# EAGLE design System critical signals PCB (EAGLE 9.5.0)
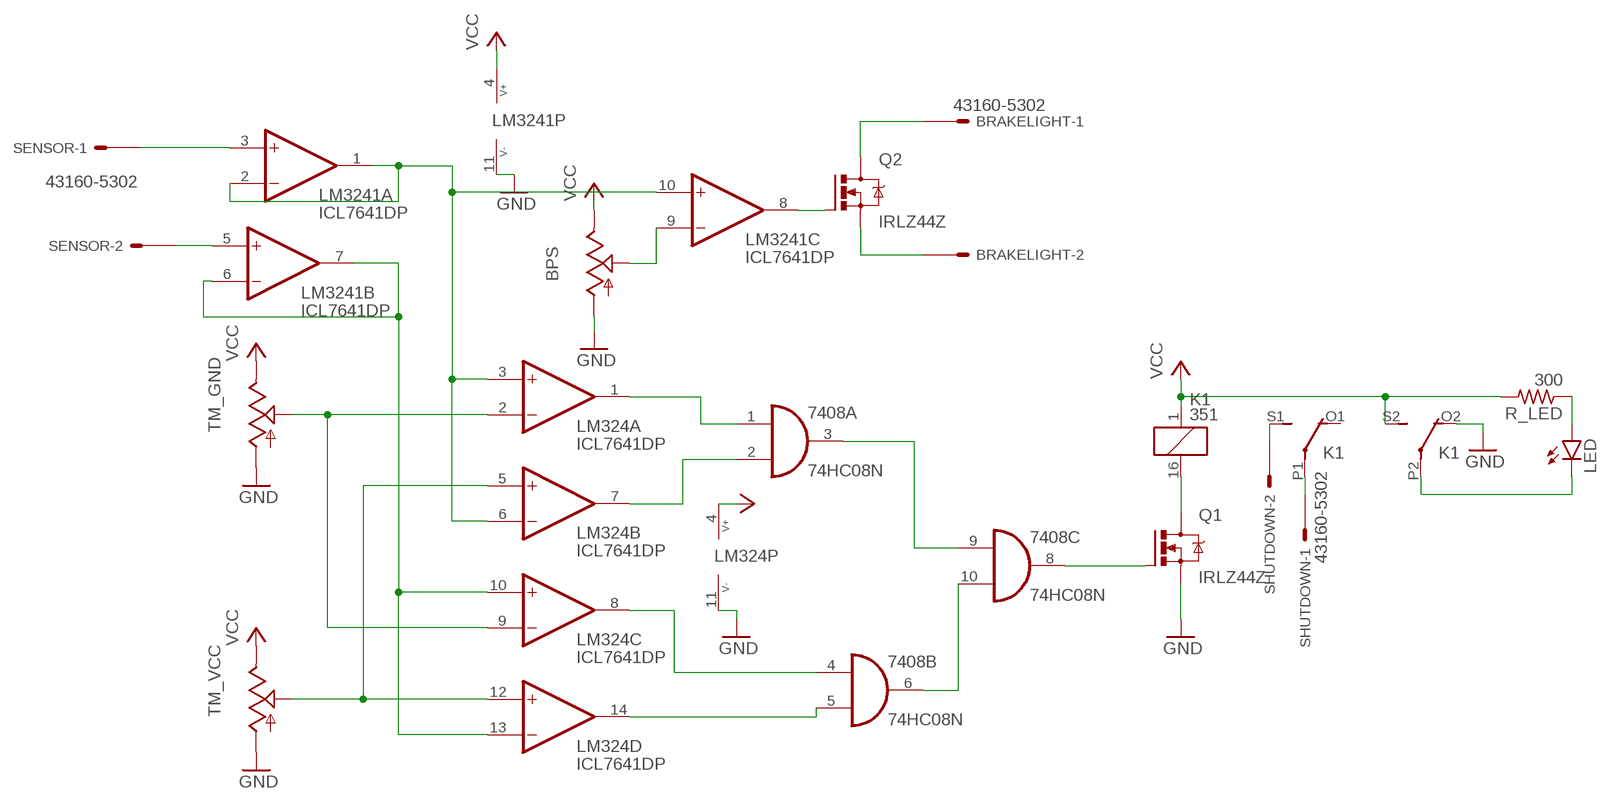
[diagram p0: schematic, sheet 1]

## Parts
7408  74HC08N  [DIL14]
BPS  TRIM  [6MM]
BRAKELIGHT  43160-5302  [43160-XX02]
K1  351  [351]
LED  LEDCHIP-LED0805  [CHIP-LED0805]
LM324  ICL7641DP  [DIL14]
LM3241  ICL7641DP  [DIL14]
Q1  IRLZ44Z  [TO220BH]
Q2  IRLZ44Z  [TO220BH]
R_LED  300  R-US_M0805  [M0805]
SENSOR  43160-5302  [43160-XX02]
SHUTDOWN  43160-5302  [43160-XX02]
TM_GND  TRIM  [6MM]
TM_VCC  TRIM  [6MM]

## Nets
BPS: LM3241.3(A:+IN) SENSOR.1@1(-1:S)
GND: BPS.A K1.O2(3:O) LM324.11(P:V-) LM3241.11(P:V-) Q1.S TM_GND.A TM_VCC.A
N$1: 7408.4(B:I0) LM324.8(C:OUT)
N$2: LM324.3(A:+IN) LM324.6(B:-IN) LM3241.1(A:OUT) LM3241.2(A:-IN) LM3241.10(C:+IN)
N$3: LM324.10(C:+IN) LM324.13(D:-IN) LM3241.6(B:-IN) LM3241.7(B:OUT)
N$4: 7408.5(B:I1) LM324.14(D:OUT)
N$5: 7408.1(A:I0) LM324.1(A:OUT)
N$6: 7408.2(A:I1) LM324.7(B:OUT)
N$7: 7408.3(A:O) 7408.9(C:I0)
N$8: 7408.6(B:O) 7408.10(C:I1)
N$9: 7408.8(C:O) Q1.G
N$10: K1.16 Q1.D
N$11: K1.S1(2:S) SHUTDOWN.2@1(-2:S)
N$12: K1.P1(2:P) SHUTDOWN.1@1(-1:S)
N$13: LED.A R_LED.1
N$14: BPS.S LM3241.9(C:-IN)
N$15: LM3241.8(C:OUT) Q2.G
N$16: BRAKELIGHT.1@1(-1:S) Q2.D
N$17: BRAKELIGHT.2@1(-2:S) Q2.S
N$18: K1.P2(3:P) LED.C
N$23: LM324.2(A:-IN) LM324.9(C:-IN) TM_GND.S
N$25: LM324.5(B:+IN) LM324.12(D:+IN) TM_VCC.S
TPS: LM3241.5(B:+IN) SENSOR.2@1(-2:S)
VCC: BPS.E K1.1 K1.S2(3:S) LM324.4(P:V+) LM3241.4(P:V+) R_LED.2 TM_GND.E TM_VCC.E
Unconnected: 7408.11(D:O) 7408.12(D:I0) 7408.13(D:I1) BRAKELIGHT.1@2(-1:S) BRAKELIGHT.2@2(-2:S) K1.O1(2:O) LM3241.12(D:+IN) LM3241.13(D:-IN) LM3241.14(D:OUT) SENSOR.1@2(-1:S) SENSOR.2@2(-2:S) SHUTDOWN.1@2(-1:S) SHUTDOWN.2@2(-2:S)

## Power pins joined to a net without a drawn wire
GND: 7408.7(P:GND)
VCC: 7408.14(P:VCC)

## Library data of the parts
7408 = 74xx-eu:74*08: Quad 2-input AND gate
BPS TM_GND TM_VCC = adafruit:TRIM
BRAKELIGHT SENSOR SHUTDOWN = con-molex:43160-*02: SDA-43160 Connector Source: http://www.molex.com/pdm_docs/sd/431601306_sd.pdf; MF: MOLEX; MPN: 43160-5302; OC_FARNELL: unknown; OC_NEWARK: 92M1498
K1 = relay:351: RELAY 2 x switch, Omron; OC_FARNELL: unknown; OC_NEWARK: unknown
LED = led:LED: LED OSRAM: - CHIPLED LG R971, LG N971, LY N971, LG Q971, LY Q971, LO R971, LY R971 LH N974, LH R974 LS Q976, LO Q976, LY Q976 LO Q996 - Hyper CHIPLED LW Q18S LB Q993, LB Q99A, LB R99A - SideLED LS A670, LO A670, LY A670, LG A670, LP A670 LB A673, LV A673, LT A673, LW A673 LH A674 LY A675 LS A676, LA A676, LO A676, LY A676, LW A676 LS A679, LY A679, LG A679 - Hyper Micro SIDELED® LS Y876, LA Y876, LO Y876, LY Y876 LT Y87S - SmartLED LW L88C, LW L88S LB L89C, LB L89S, LG L890 LS L89K, LO L89K, LY L89K LS L896, LA L896, LO L896, LY L896 - TOPLED LS T670, LO T670, LY T670, LG T670, LP T670 LSG T670, LSP T670, LSY T670, LOP T670, LYG T670 LG T671, LOG T671, LSG T671 LB T673, LV T673, LT T673, LW T673 LH T674 LS T676, LA T676, LO T676, LY T676, LB T676, LH T676, LSB T676, LW T676 LB T67C, LV T67C, LT T67C, LS T67K, LO T67K, LY T67K, LW E67C LS E67B, LA E67B, LO E67B, LY E67B, LB E67C, LV E67C, LT E67C LW T67C LS T679, LY T679, LG T679 LS T770, LO T770, LY T770, LG T770, LP T770 LB T773, LV T773, LT T773, LW T773 LH T774 LS E675, LA E675, LY E675, LS T675 LS T776, LA T776, LO T776, LY T776, LB T776 LHGB T686 LT T68C, LB T68C - Hyper Mini TOPLED® LB M676 - Mini TOPLED Santana® LG M470 LS M47K, LO M47K, LY M47K Source: http://www.osram.convergy.de LUXEON: - LUMILED® LXK2-PW12-R00, LXK2-PW12-S00, LXK2-PW14-U00, LXK2-PW14-V00 LXK2-PM12-R00, LXK2-PM12-S00, LXK2-PM14-U00 LXK2-PE12-Q00, LXK2-PE12-R00, LXK2-PE12-S00, LXK2-PE14-T00, LXK2-PE14-U00 LXK2-PB12-K00, LXK2-PB12-L00, LXK2-PB12-M00, LXK2-PB14-N00, LXK2-PB14-P00, LXK2-PB14-Q00 LXK2-PR12-L00, LXK2-PR12-M00, LXK2-PR14-Q00, LXK2-PR14-R00 LXK2-PD12-Q00, LXK2-PD12-R00, LXK2-PD12-S00 LXK2-PH12-R00, LXK2-PH12-S00 LXK2-PL12-P00, LXK2-PL12-Q00, LXK2-PL12-R00 Source: www.luxeon.com KINGBRIGHT: KA-3528ASYC Source: www.kingbright.com
LM324 LM3241 = maxim:ICL764*: Quad Operational Amplifiers Source: http://datasheets.maxim-ic.com/en/ds/ICL7612-ICL764X.pdf; OC_FARNELL: unknown; OC_NEWARK: unknown
Q1 Q2 = transistor-power:IRLZ44Z: N-Channel HEXFET® Power MOSFET Logic Level AUTOMOTIVE MOSFET Source: http://www.irf.com/product-info/datasheets/data/irlz44zpbf.pdf
R_LED = rcl:R-US_: RESISTOR, American symbol; SPICEPREFIX: R

## Board
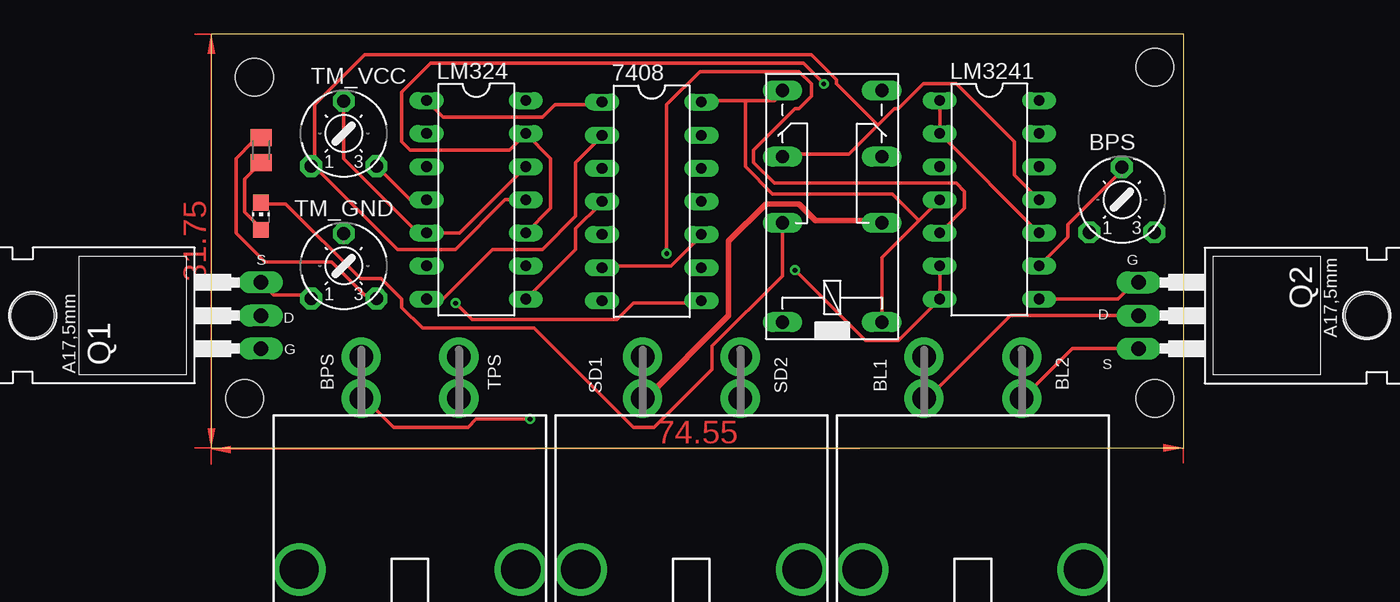
[diagram p1: board, top side]
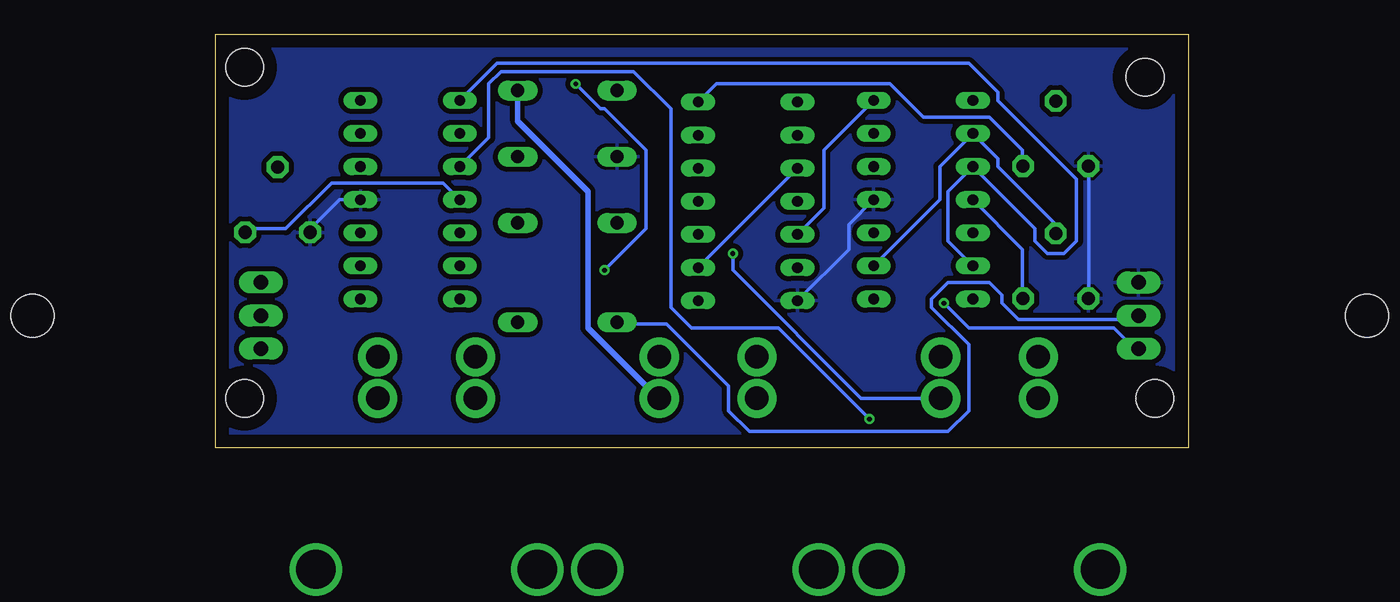
[diagram p2: board, bottom side, seen from below]

Size 74.6 x 31.74 mm. Coordinates in mm from the lower left corner, seen from the top.
Outline: 0,0 74.6,0 74.6,31.74 0,31.74 0,0
Copper layers (1*16): Top 0.035mm / dielectric 1.5mm / Bottom 0.035mm
Design rules "default *": minimum track width 10mil, minimum drill 0.35mm, track to track 15mil, track to pad 15mil, pad to pad 15mil, via to via 15mil, smd to smd 15mil, copper to edge 40mil, drill to drill 10mil, minimum pad ring 10mil, minimum via ring 8mil, stop-mask expansion 4mil, vias tented up to drill 0mil, thermal gap 10mil
Holes 2.9 mm at 72.39,3.81 72.39,29.21 3.3,28.45 2.54,3.81

### Footprints (pad centres in the part's own frame; a part is rotated, then mirrored left to right if it is on the bottom)
DIL14 = drill 0.813 long: 1 -7.62,-3.81; 2 -5.08,-3.81; 3 -2.54,-3.81; 4 0,-3.81; 5 2.54,-3.81; 6 5.08,-3.81; 7 7.62,-3.81; 8 7.62,3.81; 9 5.08,3.81; 10 2.54,3.81; 11 0,3.81; 12 -2.54,3.81; 13 -5.08,3.81; 14 -7.62,3.81
6MM = drill 1 pad 1.676 octagon: A -2.5,-2.5; E 2.5,-2.5; S 0,2.5
43160-XX02 = drill 1.8 pad 3: 1@1 -3.745,0; 1@2 -3.745,3.18; 2@1 3.745,0; 2@2 3.745,3.18 | drill 3 pad 3.4: M1 -8.495,-13.13; M2 8.495,-13.13
351 = drill 1.016 long: 1 -3.81,-3.81; 16 -3.81,3.81; O1 8.89,-3.81; O2 8.89,3.81; P1 3.81,-3.81; P2 3.81,3.81; S1 13.97,-3.81; S2 13.97,3.81
CHIP-LED0805 = smd 1.2 x 1.2: A 0,-1.05; C 0,1.05
TO220BH = drill 1.118 long: D 0,-6.35; G -2.54,-6.35; S 2.54,-6.35 | hole 3.302: 0,11.176
M0805 = smd 1.3 x 1.6: 1 -0.95,0; 2 0.95,0

### Placement (x,y rotation side)
7408  33.78,18.92 270 top
BPS  69.85,19.05 0 top
BRAKELIGHT  58.42,3.81 0 top
K1  47.62,13.46 90 top
LED  3.81,17.78 0 top
LM324  20.32,19.05 270 top
LM3241  59.69,19.05 270 top
Q1  -2.54,10.16 90 top
Q2  77.47,10.16 270 top
R_LED  3.81,22.86 90 top
SENSOR  15.24,3.81 0 top
SHUTDOWN  36.83,3.81 0 top
TM_GND  10.16,13.97 0 top
TM_VCC  10.16,24.13 0 top

### Tracks (layer width: path | path; a pad name or v marks a point on that pad's centre or on a via)
BPS  (via drill 0.35)
  Top 0.254: v24.45,2.22 20.32,2.22 19.68,1.59 13.97,1.59 11.75,3.81 SENSOR.1@1
  Bottom 0.254: LM3241.3 53.66,23.81 53.66,27.94 52.7,28.89 42.54,28.89 39.69,26.04 39.69,10.79 38.1,9.21 31.43,9.21 v24.45,2.22
GND
  Top 0.254: 51.12,24.77 52.39,26.04 52.7,26.04 54.61,27.94 57.15,27.94 61.59,23.5 61.59,20.95 LM3241.11 | 51.12,24.77 48.89,22.54 43.81,22.54 K1.O2 | Q1.S 4.76,11.75 7.62,11.75 TM_GND.A | LM324.11 22.54,19.05 18.73,15.24 14.29,15.24 7.94,21.59 TM_VCC.A 7.94,21.91 7.94,26.35 11.75,30.16 46.04,30.16 47.94,28.26 47.94,27.94 51.12,24.77
  Bottom 0.254: LM3241.11 65.09,19.05 67.31,16.83 BPS.A | 7408.7 26.04,15.24 26.04,17.14 LM324.11 | TM_VCC.A 7.62,21.59 7.62,11.75 TM_GND.A
  pour Bottom: 0,31.75 0,0 74.55,0 74.68,0.13 74.68,31.5 74.93,31.75
N$1
  Top 0.254: LM324.8 27.94,15.24 27.94,16.83 29.84,18.73 7408.4
N$2
  Top 0.254: LM3241.10 LM3241.2 LM3241.1
  Bottom 0.254: LM324.6 18.41,15.87 18.41,19.69 LM324.3 11.75,16.83 11.75,15.87 10.79,14.92 9.53,14.92 8.57,15.87 8.57,20.64 14.61,26.67 14.61,27.3 16.83,29.53 53.02,29.53 LM3241.1
N$3  (via drill 0.35)
  Top 0.254: LM3241.6 LM3241.7 52.7,8.26 50.16,8.26 v44.77,13.65 | LM324.10 26.04,18.41 26.04,22.23 LM324.13 22.86,22.86 15.24,22.86 14.61,23.5 14.61,27.3 16.83,29.53 45.4,29.53 v46.99,27.94
  Bottom 0.254: v44.77,13.65 41.59,16.83 41.59,22.86 44.77,26.04 45.08,26.04 v46.99,27.94
N$4
  Bottom 0.254: LM324.14 27.94,22.86 27.94,18.41 7408.5
N$5
  Top 0.254: LM324.1 17.78,25.4 25.4,25.4 26.35,26.35 29.84,26.35 7408.1
N$6
  Top 0.254: LM324.7 17.78,11.43 21.59,15.24 25.4,15.24 27.94,17.78 27.94,21.91 29.84,23.81 7408.2
N$7
  Bottom 0.254: 7408.9 7408.3
N$8
  Top 0.254: 7408.6 30.16,13.97 35.24,13.97 37.46,16.19 7408.10
N$9  (via drill 0.35)
  Top 0.254: v18.73,11.11 20,9.84 31.11,9.84 32.38,11.11 37.46,11.11 7408.8
  Bottom 0.254: v18.73,11.11 16.83,9.21 5.71,9.21 4.13,7.62 Q1.G
N$10
  Bottom 0.254: Q1.D 4.13,9.84 13.02,9.84 14.29,11.11 14.29,11.75 15.24,12.7 18.41,12.7 19.68,11.43 19.68,10.79 16.83,7.94 16.83,2.86 18.41,1.27 33.65,1.27 35.24,2.86 35.24,4.76 40,9.53 43.81,9.53 K1.16
N$11
  Bottom 0.254: 40.64,3.81 SHUTDOWN.2@1
  Bottom 0.406: K1.S1 51.43,25.08 46.04,19.69 46.04,9.21 40.64,3.81
N$12
  Top 0.254: 51.43,17.46 K1.P1 | 33.34,3.81 SHUTDOWN.1@1
  Top 0.406: 51.43,17.46 46.35,17.46 45.08,18.73 42.54,18.73 39.69,15.87 39.69,10.16 33.34,3.81
N$13
  Top 0.254: LED.A 3.81,16.83 2.54,18.1 2.54,20.64 R_LED.1
N$14
  Top 0.254: LM3241.9 65.72,16.19 65.72,17.14 69.85,21.27 BPS.S
N$15
  Top 0.254: LM3241.8 69.53,11.43 70.8,12.7 Q2.G
N$16
  Top 0.254: Q2.D 61.28,10.16 54.93,3.81 BRAKELIGHT.1@1
N$17
  Top 0.254: Q2.S 66.04,7.62 62.23,3.81 BRAKELIGHT.2@1
N$18
  Top 0.254: K1.P2 43.81,13.21 38.42,7.81 38.42,6.03 33.97,1.59 32.38,1.59 24.77,9.21 16.19,9.21 14.61,10.79 14.61,11.43 13.02,13.02 11.43,13.02 5.71,18.73 3.81,18.73 LED.C
N$23
  Bottom 0.254: LM324.9 19.05,19.05 19.05,21.59 LM324.2 14.61,22.23 14.61,21.59 10.16,17.14 TM_GND.S
N$25
  Top 0.254: LM324.12 19.05,16.51 LM324.5 15.88,16.51 10.16,22.23 TM_VCC.S
TPS  (via drill 0.35)
  Top 0.254: LM3241.5 57.78,18.41 57.78,19.69 57.15,20.32 43.18,20.32 41.59,21.91 41.59,22.86 44.77,26.04 45.08,26.04 46.04,26.99 46.04,27.94 45.08,28.89 37.46,28.89 34.92,26.35 v34.92,14.92
  Bottom 0.254: v34.92,14.92 34.92,13.65 25.08,3.81 SENSOR.2@1
VCC
  Top 0.254: LM324.4 15.24,19.05 TM_VCC.E | R_LED.2 3.81,23.5 3.18,23.5 1.9,22.23 1.9,16.51 4.13,14.29 9.21,14.29 11.75,11.75 12.38,11.75 TM_GND.E | 40.96,26.67 43.18,26.67 43.81,27.3 K1.S2 | 40.96,26.67 37.78,26.67 7408.14 | 54.29,17.46 51.43,14.6 K1.1 | 54.29,17.46 LM3241.4 | 40.96,26.67 40.96,21.59 43.05,19.5 52.26,19.5 54.29,17.46
  Bottom 0.254: LM324.4 12.7,15.24 12.7,11.75 TM_GND.E | LM3241.4 57.15,20.32 65.72,20.32 69.22,16.83 72.07,16.83 BPS.E | 7408.14 36.2,27.94 22.86,27.94 20.32,25.4 15.24,25.4 12.7,22.86 12.7,21.91 TM_VCC.E
(copper drawn outside any net)
  shapes: Top area x2

### Text on the board
tPlace: S | G | D | D | G | S | BPS | TPS | SD1 | SD2 | BL1 | BL2